# Altium schematic sheet Smart_Lighting_System.SchDoc
size A; SheetNumber: 2; SheetTotal: 2
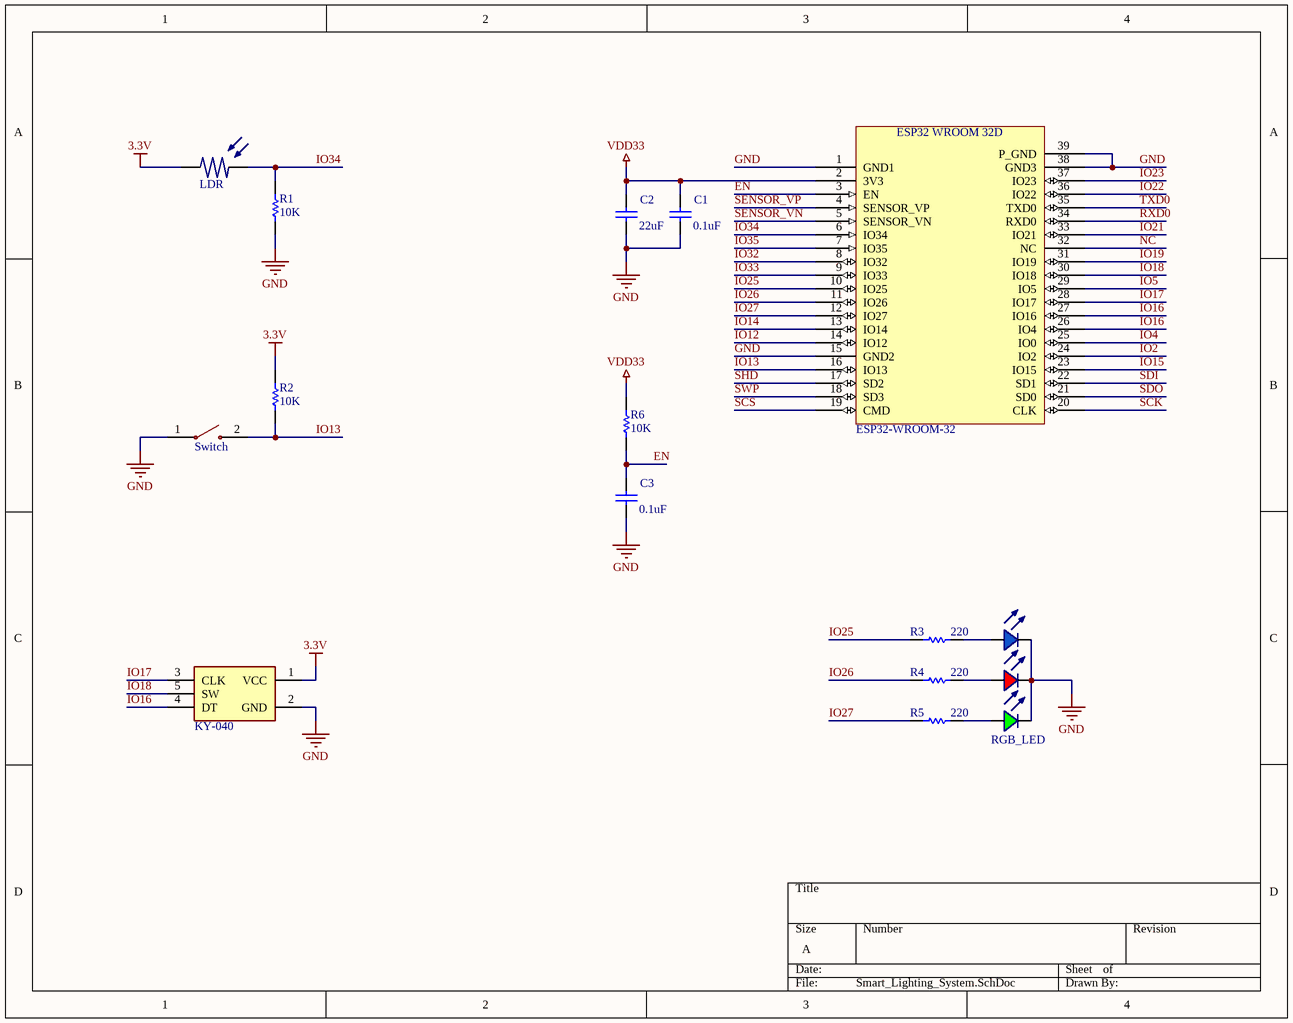
[diagram p0: Smart_Lighting_System.SchDoc]

## Parts
(Parts that share a designator on the sheet are numbered #1, #2 ... from top to bottom, then left to right.)
*#1  LDR
*#2  Switch
*#3  KY-040
C1  value 0.1uF  (hidden comment: Capacitor)
C2  value 22uF  (hidden comment: Capacitor)
C3  value 0.1uF  (hidden comment: Capacitor)
ESP32  ESP32-WROOM-32
R1  value 10K  (hidden comment: Resistor)
R2  value 10K  (hidden comment: Resistor)
R3  value 220  (hidden comment: Resistor)
R4  value 220  (hidden comment: Resistor)
R5  value 220  (hidden comment: Resistor)
R6  value 10K  (hidden comment: Resistor)
RGB_LED  RGB_LED  (value not drawn)

## Nets
3.3V: *#1.1 *#3.1(VCC) R2.2
GND: *#2.1 *#3.2(GND) C1.1 C2.1 C3.1 ESP32.1(GND1) ESP32.15(GND2) ESP32.38(GND3) ESP32.39(P_GND) R1.1 RGB_LED.1 RGB_LED.3 RGB_LED.5
VDD33: C1.2 C2.2 ESP32.2(3V3) R6.2
EN: C3.2 ESP32.3(EN) R6.1
IO2: ESP32.24(IO2)
IO4: ESP32.25(IO0)
IO5: ESP32.29(IO5)
IO12: ESP32.14(IO12)
IO13: *#2.2 ESP32.16(IO13) R2.1
IO14: ESP32.13(IO14)
IO15: ESP32.23(IO15)
IO16: *#3.4(DT) ESP32.26(IO4) ESP32.27(IO16)
IO17: *#3.3(CLK) ESP32.28(IO17)
IO18: *#3.5(SW) ESP32.30(IO18)
IO19: ESP32.31(IO19)
IO21: ESP32.33(IO21)
IO22: ESP32.36(IO22)
IO23: ESP32.37(IO23)
IO25: ESP32.10(IO25) R3.1
IO26: ESP32.11(IO26) R4.1
IO27: ESP32.12(IO27) R5.1
IO32: ESP32.8(IO32)
IO33: ESP32.9(IO33)
IO34: *#1.2 ESP32.6(IO34) R1.2
IO35: ESP32.7(IO35)
NC: ESP32.32(NC)
RXD0: ESP32.34(RXD0)
SCK: ESP32.20(CLK)
SCS: ESP32.19(CMD)
SDI: ESP32.22(SD1)
SDO: ESP32.21(SD0)
SENSOR_VN: ESP32.5(SENSOR_VN)
SENSOR_VP: ESP32.4(SENSOR_VP)
SHD: ESP32.17(SD2)
SWP: ESP32.18(SD3)
TXD0: ESP32.35(TXD0)
NetR3_2: R3.2 RGB_LED.2
NetR4_2: R4.2 RGB_LED.4
NetR5_2: R5.2 RGB_LED.6

## Notes on the sheet
- (in symbol Component_1) ESP32 WROOM 32D

## Library data of the parts
*#1-*#3 ESP32 RGB_LED = Component_1
C1-C3 = Capacitor: SimulationGenericComponent: True
R1-R6 = Resistor: TC1: 0; SimulationGenericComponent: True; TC2: 0